# EAGLE design M452xx (EAGLE 6.6.0)
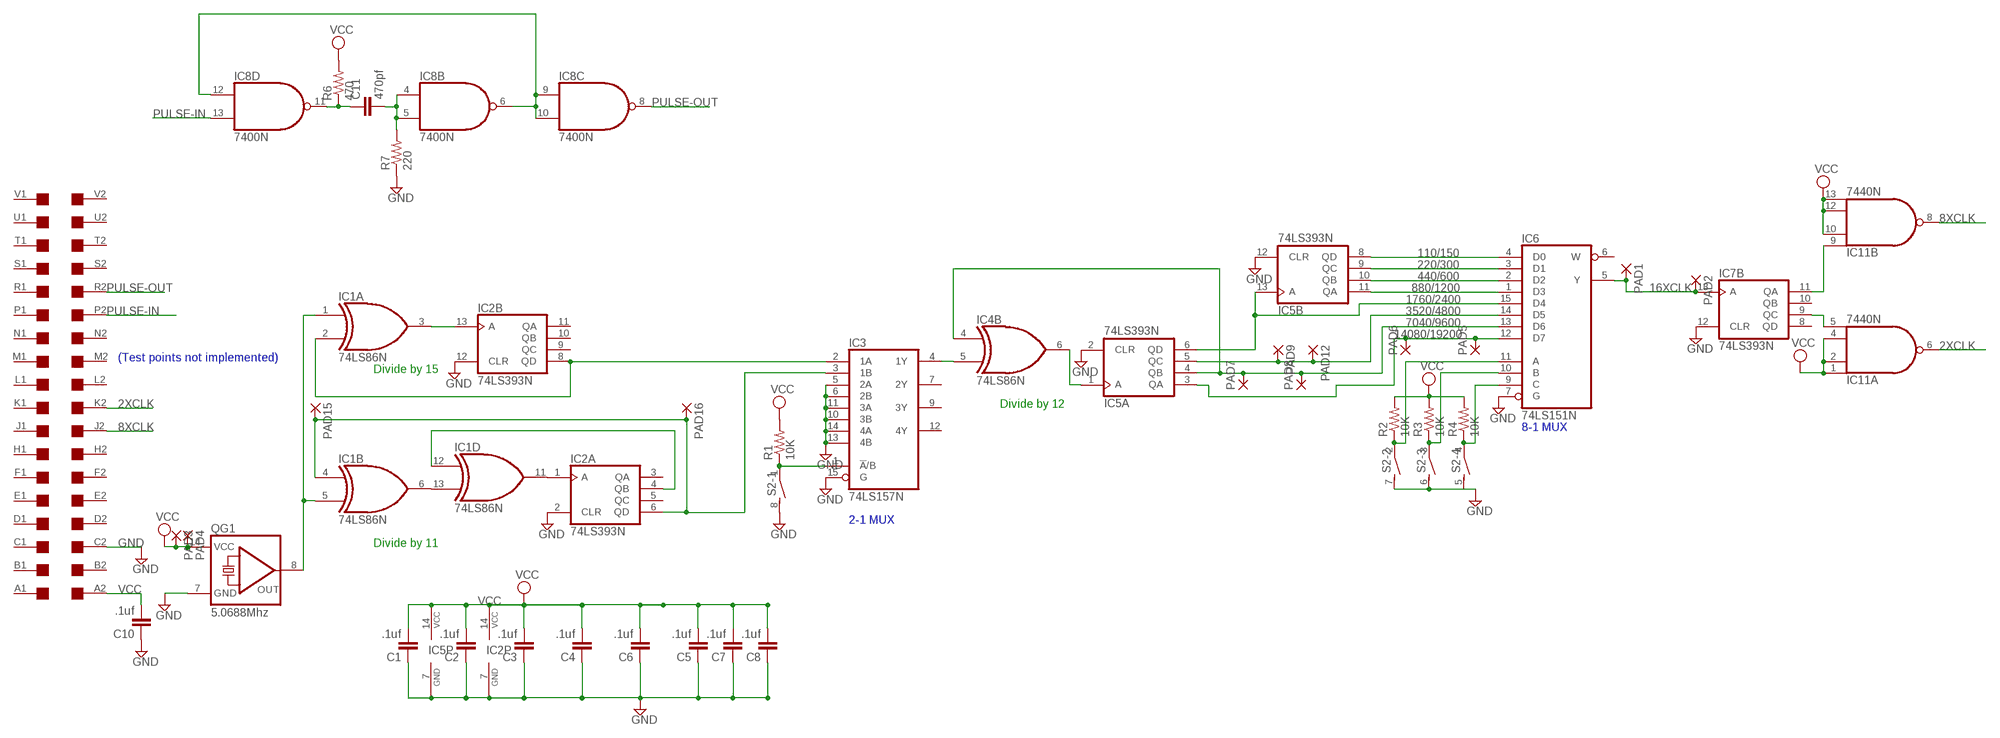
[diagram p0: schematic, sheet 1]

## Parts
C1  .1uf  C-EU050-025X075  [C050-025X075]
C2  .1uf  C-EU050-025X075  [C050-025X075]
C3  .1uf  C-EU050-025X075  [C050-025X075]
C4  .1uf  C-EU050-025X075  [C050-025X075]
C5  .1uf  C-EU050-025X075  [C050-025X075]
C6  .1uf  C-EU050-025X075  [C050-025X075]
C7  .1uf  C-EU050-025X075  [C050-025X075]
C8  .1uf  C-EU050-025X075  [C050-025X075]
C10  .1uf  C-EU050-025X075  [C050-025X075]
C11  470pf  C-EU050-025X075  [C050-025X075]
IC1  74LS86N  [DIL14]
IC2  74LS393N  [DIL14]
IC3  74LS157N  [DIL16]
IC4  74LS86N  [DIL14]
IC5  74LS393N  [DIL14]
IC6  74LS151N  74151N  [DIL16]
IC7  74LS393N  [DIL14]
IC8  7400N  [DIL14]
IC11  7440N  74S20N  [DIL14]
PAD1  1,6/0,8  [1,6/0,8]
PAD2  1,6/0,8  [1,6/0,8]
PAD3  1,6/0,8  [1,6/0,8]
PAD4  1,6/0,8  [1,6/0,8]
PAD5  1,6/0,8  [1,6/0,8]
PAD6  1,6/0,8  [1,6/0,8]
PAD7  1,6/0,8  [1,6/0,8]
PAD8  1,6/0,8  [1,6/0,8]
PAD9  1,6/0,8  [1,6/0,8]
PAD12  1,6/0,8  [1,6/0,8]
PAD15  1,6/0,8  [1,6/0,8]
PAD16  1,6/0,8  [1,6/0,8]
QG1  5.0688Mhz  QG5860  [DIL14S]
R1  10K  R-US_0204/7  [0204/7]
R2  10K  R-US_0204/7  [0204/7]
R3  10K  R-US_0204/7  [0204/7]
R4  10K  R-US_0204/7  [0204/7]
R6  470  R-US_0204/7  [0204/7]
R7  220  R-US_0204/7  [0204/7]
S2  DIP04S  [DIP04S]
U$1  DEC-FLIPCHIP  [DEC-FLIPCHIP]

## Nets
2XCLK: IC11.6(A:O) U$1.K2
8XCLK: IC11.8(B:O) U$1.J2
16XCLK: IC6.5(Y) IC7.13(B:A) PAD1.1(P) PAD2.1(P)
110/150: IC5.8(B:QD) IC6.4(D0)
220/300: IC5.9(B:QC) IC6.3(D1)
440/600: IC5.10(B:QB) IC6.2(D2)
880/1200: IC5.11(B:QA) IC6.1(D3)
1760/2400: IC5.6(A:QD) IC5.13(B:A) IC6.15(D4)
3520/4800: IC5.5(A:QC) IC6.14(D5) PAD9.1(P) PAD12.1(P)
7040/9600: IC4.4(B:I0) IC5.4(A:QB) IC6.13(D6) PAD7.1(P) PAD8.1(P)
14080/19200: IC5.3(A:QA) IC6.12(D7) PAD5.1(P) PAD6.1(P)
GND: C1.1 C2.1 C3.1 C4.1 C5.1 C6.1 C7.1 C8.1 C10.1 IC2.2(A:CLR) IC2.7(P:GND) IC2.12(B:CLR) IC3.5(2A) IC3.6(2B) IC3.10(3B) IC3.11(3A) IC3.13(4B) IC3.14(4A) IC3.15(G) IC5.2(A:CLR) IC5.7(P:GND) IC5.12(B:CLR) IC6.7(G) IC7.12(B:CLR) QG1.7(GND) R7.1 S2.5 S2.6 S2.7 S2.8 U$1.C2
N$1: IC1.1(A:I0) IC1.5(B:I1) QG1.8(OUT)
N$2: IC1.2(A:I1) IC2.8(B:QD) IC3.2(1A)
N$3: IC1.4(B:I0) IC2.6(A:QD) IC3.3(1B) PAD15.1(P) PAD16.1(P)
N$4: C11.2 IC8.4(B:I0) IC8.5(B:I1) R7.2
N$5: C11.1 IC8.11(D:O) R6.1
N$6: IC1.3(A:O) IC2.13(B:A)
N$7: IC1.11(D:O) IC2.1(A:A)
N$8: IC6.11(A) R2.1 S2.2
N$9: IC3.4(1Y) IC4.5(B:I1)
N$10: IC7.9(B:QC) IC11.5(A:I3)
N$11: IC4.6(B:O) IC5.1(A:A)
N$12: IC7.11(B:QA) IC11.9(B:I0)
N$13: IC6.10(B) R3.1 S2.3
N$14: IC6.9(C) R4.1 S2.4
N$15: IC1.6(B:O) IC1.13(D:I1)
N$16: IC8.6(B:O) IC8.9(C:I0) IC8.10(C:I1) IC8.12(D:I0)
N$17: IC3.1(!A!/B) R1.1 S2.1
N$19: IC1.12(D:I0) IC2.4(A:QB)
PULSE-IN: IC8.13(D:I1) U$1.P2
PULSE-OUT: IC8.8(C:O) U$1.R2
VCC: C1.2 C2.2 C3.2 C4.2 C5.2 C6.2 C7.2 C8.2 C10.2 IC2.14(P:VCC) IC5.14(P:VCC) IC11.1(A:I0) IC11.2(A:I1) IC11.4(A:I2) IC11.10(B:I1) IC11.12(B:I2) IC11.13(B:I3) PAD3.1(P) PAD4.1(P) QG1.14(VCC) R1.2 R2.2 R3.2 R4.2 R6.2 U$1.A2
Unconnected: IC1.8(C:O) IC1.9(C:I0) IC1.10(C:I1) IC2.3(A:QA) IC2.5(A:QC) IC2.9(B:QC) IC2.10(B:QB) IC2.11(B:QA) IC3.7(2Y) IC3.9(3Y) IC3.12(4Y) IC4.1(A:I0) IC4.2(A:I1) IC4.3(A:O) IC4.8(C:O) IC4.9(C:I0) IC4.10(C:I1) IC4.11(D:O) IC4.12(D:I0) IC4.13(D:I1) IC6.6(W) IC7.1(A:A) IC7.2(A:CLR) IC7.3(A:QA) IC7.4(A:QB) IC7.5(A:QC) IC7.6(A:QD) IC7.8(B:QD) IC7.10(B:QB) IC8.1(A:I0) IC8.2(A:I1) IC8.3(A:O) U$1.A1 U$1.B1 U$1.B2 U$1.C1 U$1.D1 U$1.D2 U$1.E1 U$1.E2 U$1.F1 U$1.F2 U$1.H1 U$1.H2 U$1.J1 U$1.K1 U$1.L1 U$1.L2 U$1.M1 U$1.M2 U$1.N1 U$1.N2 U$1.P1 U$1.R1 U$1.S1 U$1.S2 U$1.T1 U$1.T2 U$1.U1 U$1.U2 U$1.V1 U$1.V2

## Notes on the sheet
- (Test points not implemented)
- Divide by 15
- Divide by 12
- 8-1 MUX
- 2-1 MUX
- Divide by 11

## Power pins joined to a net without a drawn wire
GND: IC1.7(P:GND) IC3.8(GND) IC4.7(P:GND) IC6.8(GND) IC7.7(P:GND) IC8.7(P:GND) IC11.7(P:GND)
VCC: IC1.14(P:VCC) IC3.16(VCC) IC4.14(P:VCC) IC6.16(VCC) IC7.14(P:VCC) IC8.14(P:VCC) IC11.14(P:VCC)

## Library data of the parts
C1-C8 C10 C11 = rcl:C-EU: CAPACITOR, European symbol
IC1 IC4 = 74xx-us:74*86: Quad 2-input EXCLUSIV-OR (XOR) gate
IC2 IC5 IC7 = 74xx-us:74*393: Dual 4-bit decade and binary COUNTER
IC3 = 74xx-us:74*157: Quadruple 2-line to 1-line data SELECTOR/MULTIPLEXER
IC6 = 74xx-us:74*151: Data SELECTOR/MULTIPLEXER
IC8 = 74xx-us:74*00: Quad 2-input NAND gate
IC11 = 74xx-us:74*20: Dual 4-input NAND gate
PAD1-PAD9 PAD12 PAD15 PAD16 = wirepad:1,6/0,8: THROUGH-HOLE PAD
QG1 = crystal:QG5860: CRYSTAL RESONATOR; OC_FARNELL: unknown; OC_NEWARK: unknown
R1-R4 R6 R7 = rcl:R-US_: RESISTOR, American symbol
S2 = switch-dil:DIP04S: DIL/CODE SWITCH; OC_FARNELL: unknown; OC_NEWARK: unknown
U$1 = con-dec:DEC-FLIPCHIP: DEC Flip-Chip single card fingers

## Board
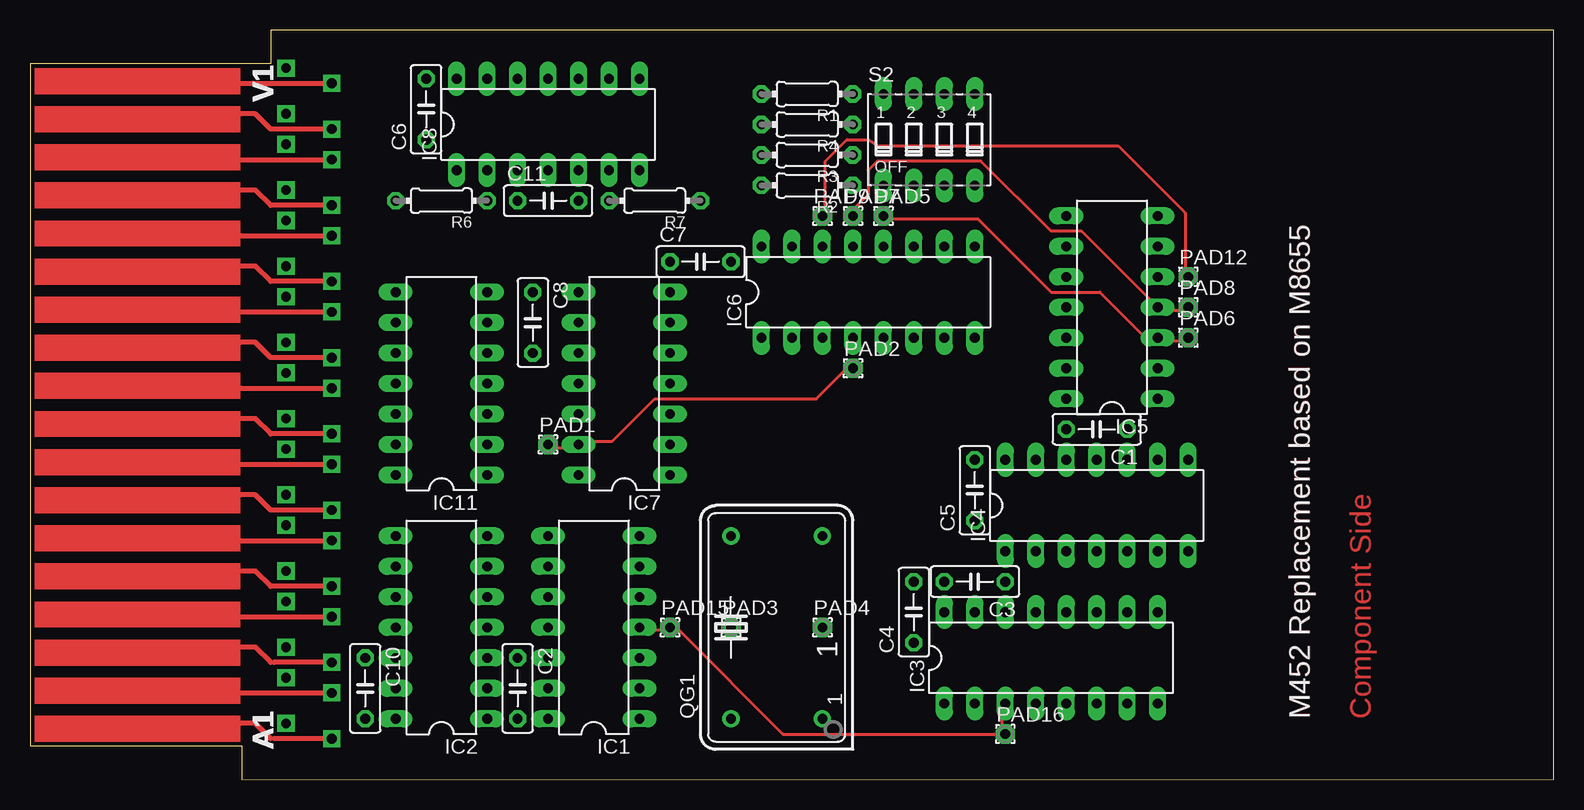
[diagram p1: board, top side]
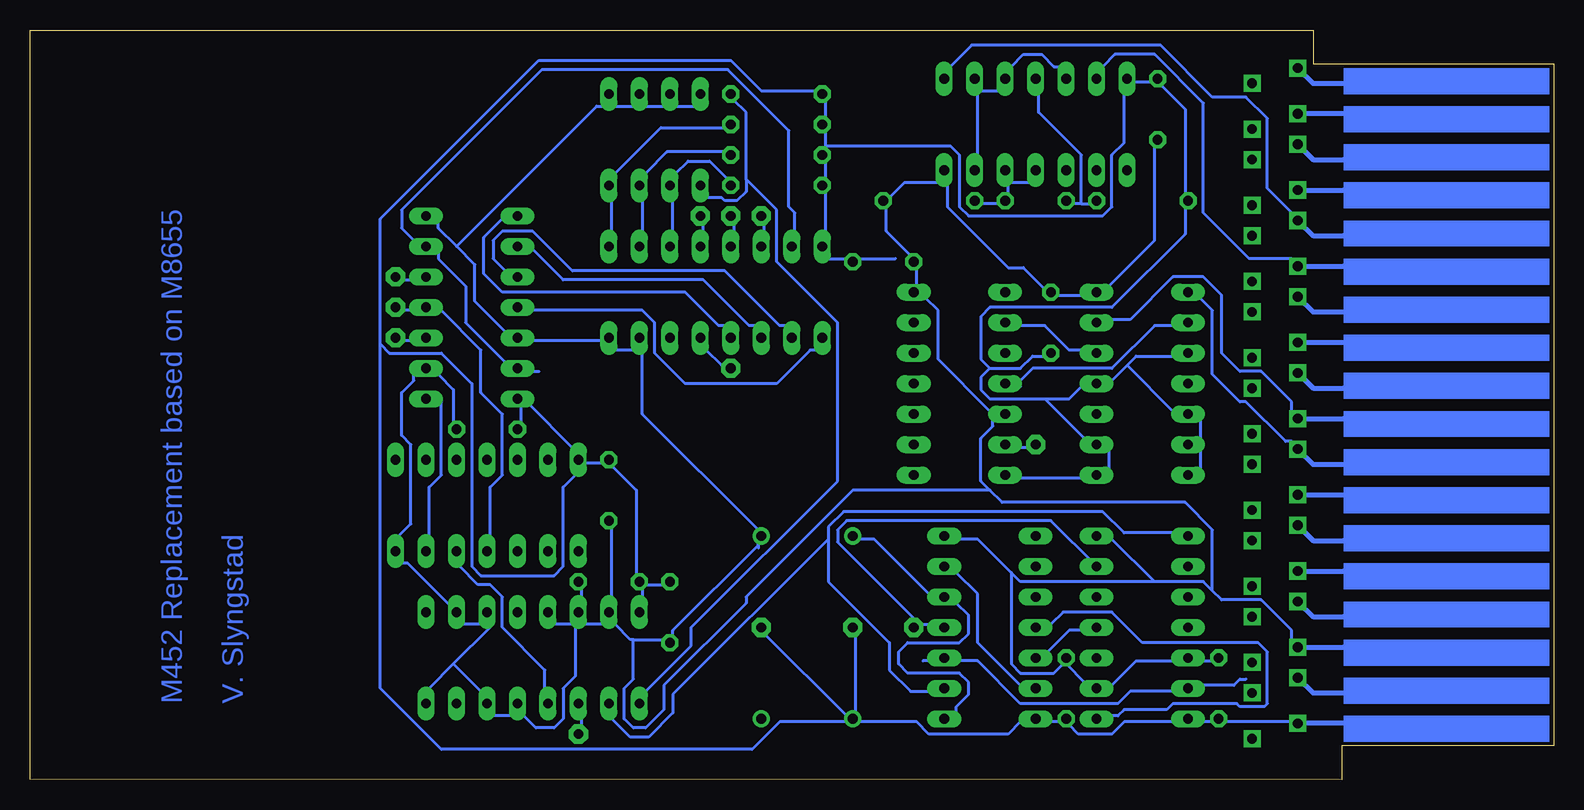
[diagram p2: board, bottom side, seen from below]

Size 126.98 x 62.48 mm. Coordinates in mm from the lower left corner, seen from the top.
Outline: 0,2.83 17.65,2.83 17.65,0 126.98,0.04 126.98,62.45 20.06,62.48 20.06,59.65 0,59.65 0,2.83
Copper layers (1*16): Top 0.035mm / dielectric 1.5mm / Bottom 0.035mm
Design rules "10mils": minimum track width 10mil, minimum drill 28mil, track to track 15mil, track to pad 10mil, pad to pad 10mil, via to via 10mil, smd to smd 10mil, copper to edge 40mil, drill to drill 10mil, minimum pad ring 12mil, minimum via ring 8mil, stop-mask expansion 0mil, vias tented up to drill 0mil, thermal gap 10mil

### Footprints (pad centres in the part's own frame; a part is rotated, then mirrored left to right if it is on the bottom)
C050-025X075 = drill 0.813 octagon: 1 -2.54,0; 2 2.54,0
DIL14 = drill 0.813 long: 1 -7.62,-3.81; 2 -5.08,-3.81; 3 -2.54,-3.81; 4 0,-3.81; 5 2.54,-3.81; 6 5.08,-3.81; 7 7.62,-3.81; 8 7.62,3.81; 9 5.08,3.81; 10 2.54,3.81; 11 0,3.81; 12 -2.54,3.81; 13 -5.08,3.81; 14 -7.62,3.81
DIL16 = drill 0.813 long: 1 -8.89,-3.81; 2 -6.35,-3.81; 3 -3.81,-3.81; 4 -1.27,-3.81; 5 1.27,-3.81; 6 3.81,-3.81; 7 6.35,-3.81; 8 8.89,-3.81; 9 8.89,3.81; 10 6.35,3.81; 11 3.81,3.81; 12 1.27,3.81; 13 -1.27,3.81; 14 -3.81,3.81; 15 -6.35,3.81; 16 -8.89,3.81
1,6/0,8 = drill 0.813 pad 1.6 octagon: 1 0,0
DIL14S = drill 0.813: 1 -7.62,-3.81; 7 7.62,-3.81; 8 7.62,3.81; 14 -7.62,3.81
0204/7 = drill 0.813 octagon: 1 -3.81,0; 2 3.81,0
DIP04S = drill 0.813 long: 1 -3.81,-3.81; 2 -1.27,-3.81; 3 1.27,-3.81; 4 3.81,-3.81; 5 3.81,3.81; 6 1.27,3.81; 7 -1.27,3.81; 8 -3.81,3.81
DEC-FLIPCHIP = drill 0.813 square: A1 -7.62,27.94; A2 -3.81,26.67; B1 -7.62,24.13; B2 -3.81,22.86; C1 -7.62,21.59; C2 -3.81,20.32; D1 -7.62,17.78; D2 -3.81,16.51; E1 -7.62,15.24; E2 -3.81,13.97; F1 -7.62,11.43; F2 -3.81,10.16; H1 -7.62,8.89; H2 -3.81,7.62; J1 -7.62,5.08; J2 -3.81,3.81; K1 -7.62,2.54; K2 -3.81,1.27; L1 -7.62,-1.27; L2 -3.81,-2.54; M1 -7.62,-3.81; M2 -3.81,-5.08; N1 -7.62,-7.62; N2 -3.81,-8.89; P1 -7.62,-10.16; P2 -3.81,-11.43; R1 -7.62,-13.97; R2 -3.81,-15.24; S1 -7.62,-16.51; S2 -3.81,-17.78; T1 -7.62,-20.32; T2 -3.81,-21.59; U1 -7.62,-22.86; U2 -3.81,-24.13; V1 -7.62,-26.67; V2 -3.81,-27.94

### Placement (x,y rotation side)
C1  88.9,29.21 180 top
C2  40.63,7.62 270 top
C3  78.73,16.51 180 top
C4  73.66,13.97 90 top
C5  78.73,24.13 90 top
C6  33.02,55.88 90 top
C7  55.88,43.18 0 top
C8  41.9,38.1 270 top
C10  27.94,7.62 270 top
C11  43.17,48.26 0 top
IC1  46.98,12.7 90 top
IC2  34.28,12.7 90 top
IC3  85.09,10.16 0 top
IC4  88.9,22.86 0 top
IC5  90.17,39.37 90 top
IC6  69.84,40.64 0 top
IC7  49.52,33.02 90 top
IC8  43.17,54.61 0 top
IC11  34.28,33.02 90 top
PAD1  43.17,27.94 0 top
PAD2  68.58,34.29 0 top
PAD3  58.41,12.7 0 top
PAD4  66.04,12.7 0 top
PAD5  71.12,46.99 0 top
PAD6  96.52,36.83 0 top
PAD7  68.58,46.99 0 top
PAD8  96.52,39.37 0 top
PAD9  66.04,46.99 0 top
PAD12  96.52,41.91 0 top
PAD15  53.34,12.7 0 top
PAD16  81.28,3.81 0 top
QG1  62.22,12.7 90 top
R1  64.77,57.15 180 top
R2  64.77,49.53 180 top
R3  64.77,52.07 180 top
R4  64.77,54.61 180 top
R6  34.28,48.26 180 top
R7  52.06,48.26 180 top
S2  74.93,53.34 0 top
U$1  17.52,31.37 180 top

### Tracks (layer width: path | path; a pad name or v marks a point on that pad's centre or on a via)
2XCLK
  Bottom 0.254: U$1.K2 21.84,30.73 21.84,31.5 24.38,34.04 26.16,34.04 27.68,35.56 27.68,40.39 29.21,41.91 31.75,41.91 35.3,38.35 36.82,38.35 IC11.6
8XCLK
  Bottom 0.254: U$1.J2 21.84,28.19 22.35,28.19 25.65,31.5 26.16,31.5 28.44,33.78 28.44,39.12 29.46,40.13 IC11.8
16XCLK
  Top 0.254: PAD1.1 43.94,27.69 44.45,27.69 IC7.13 46.98,28.19 48.51,28.19 52.06,31.75 65.53,31.75 67.81,34.04 PAD2.1
  Bottom 0.254: IC7.13 44.45,27.69 43.94,27.69 PAD1.1 | IC6.5 70.61,35.81 69.34,34.54 PAD2.1
110/150
  Bottom 0.254: IC6.4 69.08,37.85 69.59,37.85 72.39,40.64 87.62,40.64 89.15,42.16 89.15,45.21 87.62,46.74 IC5.8
220/300
  Bottom 0.254: IC6.3 66.54,37.85 67.05,37.85 70.86,41.66 82.55,41.66 85.09,44.2 IC5.9
440/600
  Bottom 0.254: IC6.2 64,37.85 64.51,37.85 69.08,42.42 81.78,42.42 85.09,45.72 87.62,45.72 88.39,44.96 88.39,43.43 87.37,42.42 IC5.10
880/1200
  Bottom 0.254: IC6.1 61.46,35.81 61.97,35.81 64.77,33.02 72.39,33.02 74.93,35.56 74.93,38.1 75.94,39.12 85.09,39.12 IC5.11
1760/2400
  Bottom 0.254: IC6.15 63.24,45.72 63.24,47.24 63.75,47.75 63.75,54.1 68.83,59.18 84.32,59.18 96.01,47.5 96.01,45.97 94.99,44.96 IC5.6 92.96,43.94 92.96,43.43 90.67,41.15 90.67,38.1 87.37,34.8 IC5.13 85.09,34.04 84.58,34.04
3520/4800
  Top 0.254: PAD9.1 66.29,47.75 66.29,51.56 68.07,53.34 69.84,53.34 70.61,52.83 90.67,52.83 96.26,47.24 96.26,42.67 PAD12.1
  Bottom 0.254: IC6.14 65.78,45.72 65.78,46.23 PAD9.1 | IC5.5 95.25,41.66 95.75,41.66 PAD12.1
7040/9600
  Top 0.254: PAD8.1 95.75,39.12 95.25,39.12 IC5.4 87.62,45.72 85.09,45.72 79.24,51.56 70.61,51.56 69.84,50.8 69.84,48.77 68.83,47.75 PAD7.1
  Bottom 0.254: IC4.4 88.64,20.32 88.64,24.38 87.62,25.4 87.62,30.48 89.4,32.26 89.4,35.81 92.7,39.12 IC5.4 95.25,39.12 95.75,39.12 PAD8.1 | IC6.13 68.32,45.72 68.32,46.23 PAD7.1
14080/19200
  Top 0.254: PAD6.1 95.75,36.58 95.25,36.58 IC5.3 92.7,37.08 89.15,40.64 85.09,40.64 78.99,46.74 71.88,46.74 PAD5.1
  Bottom 0.254: IC6.12 70.86,45.72 70.86,46.23 PAD5.1 | IC5.3 95.25,36.58 95.75,36.58 PAD6.1
GND
  Bottom 0.254: C7.1 53.08,42.67 53.08,41.15 IC7.7 52.32,40.13 51.3,39.12 51.3,35.05 46.98,30.73 IC7.12 46.73,29.97 46.73,29.46 47.75,28.45 47.75,24.89 46.98,24.13 | C10.1 28.44,9.91 29.21,9.91 IC2.12 31.75,9.91 34.79,9.91 36.82,7.87 IC2.2 39.11,8.13 40.63,9.65 C2.1 40.89,9.65 41.65,8.89 44.45,8.89 45.21,9.65 45.21,17.27 | S2.8 71.62,56.13 73.15,56.13 S2.7 74.16,56.13 75.69,56.13 S2.6 76.7,56.13 78.23,56.13 S2.5 79.24,56.13 79.75,56.13 91.44,44.45 | 91.44,44.45 89.91,42.93 89.91,39.88 87.37,37.34 IC5.12 85.09,36.58 79.24,36.58 IC6.8 78.23,35.81 76.7,35.81 IC6.7 75.94,35.56 75.94,30.48 66.29,20.83 QG1.7 66.29,19.81 66.29,19.56 | 91.44,44.45 92.96,45.97 92.96,46.48 IC5.7 | IC3.14 81.02,15.24 81.02,16 C3.1 | C5.1 78.48,21.08 78.48,15.24 IC3.15 | IC3.14 80.77,12.95 79.24,12.95 IC3.15 | C1.1 91.69,29.72 91.69,32.51 92.96,33.78 IC5.2 94.99,33.78 94.99,33.27 96.01,32.26 96.01,28.7 95.25,27.94 95.25,21.34 96.26,20.32 IC4.7 96.01,18.03 95.5,18.03 IC3.10 90.93,12.95 89.4,12.95 IC3.11 88.64,12.7 91.69,9.65 | 91.69,9.65 93.72,7.62 IC3.8 | 91.69,9.65 89.4,7.37 IC3.6 88.39,5.33 86.86,5.33 IC3.5 85.85,5.33 84.83,4.32 83.31,4.32 82.55,5.08 82.55,7.62 81.53,8.64 81.53,12.7 IC3.14 | IC3.13 83.31,12.95 81.78,12.95 IC3.14 | 76.7,11.68 74.16,11.68 C4.1 73.4,11.94 73.4,12.45 66.29,19.56 | 76.7,11.68 76.96,11.68 78.23,12.95 IC3.15 | 28.44,15.75 29.21,16.51 33.27,16.51 | 28.44,15.75 27.68,14.99 24.38,14.99 21.84,12.45 21.84,11.68 U$1.C2 | 33.27,16.51 36.82,20.07 IC2.7 | 45.21,17.27 44.45,16.51 33.27,16.51 | 45.21,17.27 48,20.07 49.52,20.07 IC1.7 | 46.98,24.13 45.97,23.11 30.73,23.11 28.44,20.83 28.44,15.75
  Bottom 0.254: 46.98,24.13 58.41,24.13 67.31,15.24 67.31,14.73 74.16,7.87 74.16,5.84 75.69,4.32 76.7,4.32 77.47,5.08 77.47,7.62 76.7,8.38 76.7,11.68 | 66.29,19.56 66.29,19.3 | IC11.7 39.36,40.39 41.4,40.39 C8.1 42.41,40.89 44.19,42.67 45.46,42.67 50.54,47.75 50.54,49.53 IC8.7 51.3,49.78 54.1,49.78 55.37,48.51 R7.1 55.62,47.75 55.62,45.72 53.59,43.69 C7.1 | C7.1 52.83,42.93 | IC11.7 39.11,41.15 | IC11.7 36.82,40.64 | C6.1 33.27,52.83 33.27,44.96 37.08,41.15 IC11.7
N$1
  Bottom 0.254: IC1.1 49.78,5.59 49.78,6.1 48.76,7.11 48.76,8.13 49.52,8.89 53.84,8.89 54.6,9.65 54.6,10.67 53.84,11.43 49.52,11.43 48.76,12.19 48.76,13.72 49.78,14.73 IC1.5 52.06,15.49 56.64,20.07 57.91,20.07 QG1.8
N$2
  Bottom 0.254: IC1.2 52.06,7.37 53.59,7.37 55.37,9.14 55.37,11.43 60.45,16.51 60.45,20.07 | 60.45,20.07 60.45,21.08 59.18,22.35 37.59,22.35 35.81,20.57 31.75,20.57 IC2.8 | IC3.2 78.48,5.08 76.96,3.56 75.43,3.56 73.4,5.59 73.4,7.11 60.45,20.07
N$3
  Top 0.254: IC3.3 81.02,5.08 81.02,4.57 PAD16.1 62.73,3.81 54.1,12.45 PAD15.1 52.57,12.45 52.06,12.45 IC1.4
  Bottom 0.254: 52.57,12.95 52.83,12.95 59.68,19.81 59.68,20.83 58.92,21.59 41.9,21.59 IC2.6 | 52.57,12.95 52.06,12.95 IC1.4 | IC3.3 81.02,5.08 81.02,4.57 PAD16.1 | 52.57,12.95 PAD15.1
N$4
  Bottom 0.254: IC8.4 43.68,49.78 45.21,49.78 IC8.5 45.46,49.53 45.46,48.77 C11.2 46.22,48.01 47.75,48.01 R7.2
N$5
  Bottom 0.254: 39.36,48.01 40.13,48.01 C11.1 | 39.36,48.01 38.6,48.01 R6.1 | 39.36,48.01 39.36,52.07 42.92,55.63 42.92,57.15 IC8.11
N$6
  Bottom 0.254: 52.57,9.91 52.06,9.91 IC1.3 49.52,9.91 48,9.91 44.45,6.35 36.32,6.35 35.3,7.37 31.75,7.37 IC2.13 29.21,7.87 26.67,7.87 26.16,8.38 25.65,8.38
N$7
  Bottom 0.254: IC2.1 36.82,5.33 36.32,5.33 35.81,5.84 32.25,5.84 31.75,6.35 26.41,6.35 26.16,6.1 24.12,6.1 23.87,6.35 23.87,10.67 24.63,11.43 34.28,11.43 36.82,13.97 40.89,13.97 41.9,12.95 IC1.11
N$8
  Bottom 0.254: IC6.11 73.4,45.72 73.4,48.26 S2.2 73.15,50.55 72.13,51.56 70.35,51.56 68.83,50.04 R2.1
N$9
  Bottom 0.254: IC3.4 84.07,7.62 84.07,9.14 87.62,12.7 87.62,15.24 88.64,16.26 89.66,16.26 91.18,17.78 IC4.5
N$10
  Bottom 0.254: IC11.5 39.36,35.81 40.38,35.81 42.41,37.85 44.45,37.85 IC7.9
N$11
  Bottom 0.254: IC4.6 93.72,20.32 93.72,24.38 92.7,25.4 92.7,31.5 IC5.1
N$12
  Bottom 0.254: 44.45,32.77 IC7.11 44.45,33.27 43.43,34.29 36.82,34.29 33.27,37.85 31.75,37.85 IC11.9
N$13
  Bottom 0.254: R3.1 69.08,52.32 73.91,52.32 75.69,50.55 S2.3 75.94,48.26 75.94,45.72 IC6.10
N$14
  Bottom 0.254: IC6.9 78.48,45.72 78.48,48.26 S2.4 78.23,50.55 74.42,54.36 69.08,54.36 R4.1
N$15
  Bottom 0.254: IC1.13 44.45,7.87 48,11.43 48,15.49 49.78,17.27 IC1.6
N$16
  Bottom 0.254: IC8.12 41.14,59.44 41.65,59.44 42.67,60.45 44.19,60.45 45.21,59.44 IC8.10 46.22,57.4 47.75,57.4 IC8.9 48,57.15 48,52.07 IC8.6
N$17
  Bottom 0.254: 67.31,50.04 67.31,55.63 68.32,56.64 R1.1 | 67.31,50.04 67.31,49.02 68.07,48.26 69.08,48.26 69.34,48.51 70.61,48.51 S2.1 | 67.31,50.04 64.77,47.5 64.77,43.18 59.68,38.1 59.68,24.89 71.88,12.7 71.88,11.18 75.69,7.37 IC3.1
N$19
  Bottom 0.254: IC2.4 39.36,12.45 40.38,12.45 42.16,10.67 IC1.12
PULSE-IN
  Bottom 0.254: U$1.P2 21.84,43.43 25.39,43.43 29.21,47.24 29.21,56.39 33.27,60.45 36.57,60.45 37.59,59.44 IC8.13
PULSE-OUT
  Bottom 0.254: U$1.R2 21.84,47.24 23.87,49.28 23.87,55.12 25.65,56.9 28.44,56.9 32.76,61.21 48.51,61.21 50.29,59.44 IC8.8
VCC
  Bottom 0.254: U$1.A2 21.84,4.83 27.43,4.83 C10.2 28.44,4.83 29.21,4.83 IC2.14 31.75,4.83 35.81,4.83 36.82,3.81 39.62,3.81 40.38,4.57 C2.2 41.14,4.83 41.9,4.83 IC1.14 44.45,4.83 45.46,3.81 52.06,3.81 53.08,4.83 57.91,4.83 QG1.14 | IC3.16 75.94,15.24 75.94,16 C3.2 | C4.2 74.16,16.26 75.69,16.26 C3.2 | IC4.14 80.77,26.42 79.24,26.42 C5.2 78.48,26.16 76.45,24.13 76.45,17.02 C3.2 | C1.2 86.1,29.72 86.1,31.24 IC5.14 85.34,31.24 81.78,27.69 IC4.14 | 97.79,36.32 97.79,46.74 84.58,59.94 68.58,59.94 66.04,57.4 61.46,57.4 R1.2 60.7,56.64 60.7,55.12 R4.2 60.7,54.1 60.7,52.83 | 97.79,36.32 97.02,35.56 92.7,35.56 90.17,33.02 90.17,17.78 89.4,17.02 83.31,17.02 82.55,17.78 82.55,24.38 81.53,25.4 IC4.14 | 97.79,36.32 97.79,7.62 92.7,2.54 66.8,2.54 64.51,4.83 58.92,4.83 QG1.14 | 58.16,11.94 58.16,5.59 QG1.14 | 58.16,11.94 58.16,12.19 | 58.16,11.94 PAD3.1 | QG1.14 58.92,5.33 65.78,12.19 PAD4.1 | 54.86,43.43 57.91,43.43 C7.2 58.92,43.43 60.45,43.43 IC6.16 60.7,45.72 60.7,49.02 R2.2 60.7,50.04 60.7,51.56 R3.2 60.7,52.58 60.7,52.83 | 60.7,52.83 50.29,52.83 49.52,52.07 49.52,47.75 48.76,46.99 37.59,46.99 36.82,47.75 36.82,52.07 35.81,53.09 35.81,57.15 IC8.14 35.05,58.17 33.52,58.17 C6.2 32.76,57.91 30.73,55.88 30.73,48.77 R6.2 30.73,47.75 30.73,45.47 36.82,39.37 46.98,39.37 47.75,38.61 47.75,35.05 46.98,34.29 | IC7.14 44.45,25.15 39.36,25.15 IC11.1 37.08,25.91 37.08,27.43 IC11.2 39.11,28.45 42.41,31.75 | IC11.14 29.46,25.91 29.46,27.43 IC11.13 29.46,28.45 29.46,29.97 IC11.12 31.75,30.73 35.55,34.54 | 35.55,34.54 36.82,33.27 IC11.4 39.36,32.77 40.38,31.75 42.41,31.75
  Bottom 0.254: 35.55,34.54 34.79,35.31 31.75,35.31 IC11.10 | 46.98,34.29 44.45,34.29 43.43,35.31 42.41,35.31 C8.2 | 46.98,34.29 47.75,33.53 47.75,32.51 46.98,31.75 42.41,31.75

### Text on the board
Top: M452 Replacement based on M8655 | Component Side
Bottom: V. Slyngstad | M452 Replacement based on M8655
tPlace: 1
tNames: V1 | V1 | V1 | V1 | V1 | V1 | V1 | V1 | V1 | V1 | V1 | V1 | V1 | V1 | V1 | V1 | V1 | V1 | V1 | V1 | V1 | V1 | V1 | V1 | V1 | V1 | V1 | V1 | V1 | V1 | V1 | V1 | M452 Replacement based on M8655 | A1 | A1 | A1 | A1 | A1 | A1 | A1 | A1 | A1 | A1 | A1 | A1 | A1 | A1 | A1 | A1 | A1 | A1 | A1 | A1 | A1 | A1 | A1 | A1 | A1 | A1 | A1 | A1 | A1 | A1 | A1 | A1